# Altium schematic sheet 2_5Reg.SchDoc
size A4
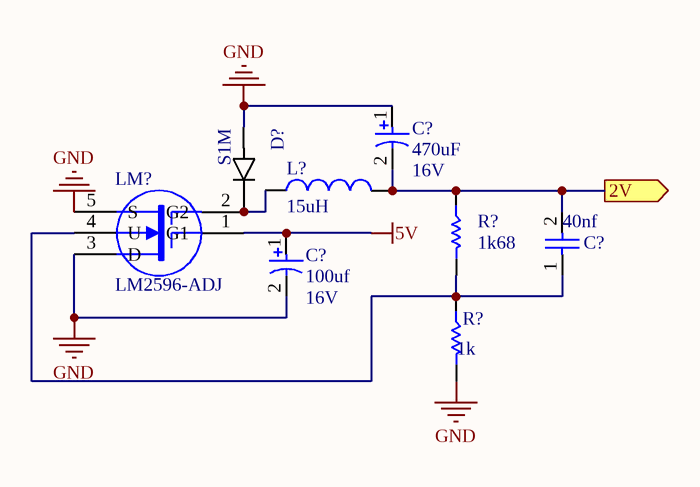
[diagram p0: 2_5Reg.SchDoc]

## Parts
(Parts that share a designator on the sheet are numbered #1, #2 ... from top to bottom, then left to right.)
C?#1  470uF  [RB5-10.5]
C?#2  40nf  [6-0805_L]
C?#3  100uf  [RB5-10.5]
D?  S1M  [*DIOM5227X270N_S1M(Primary)]
L?  15uH  [IND_SMD-13.0mm]
LM?  LM2596-ADJ  [T05A]
R?#1  1k68  [6-0805_L]
R?#2  1k  [6-0805_L]

## Ports
2V (out)

## Nets
5V: C?#3.1 LM?.1(G1)
GND: C?#1.1 C?#3.2 D?.A LM?.3(D) LM?.5(S) R?#2.2
2V: C?#1.2 C?#2.2 L?.2 R?#1.1 ; port 2V
NetC?#2_1: C?#2.1 LM?.4(U) R?#1.2 R?#2.1
NetD?_C: D?.C(K) L?.1 LM?.2(G2)

## Notes on the sheet
- Title
- Size:
- Date:
- A4
- Number:
- Time:
- Revision:
- Sheet
- of
- File:
- (in symbol CAP) 16V

## Library data of the parts
C?#1 C?#3 = CAP
C?#2 = CAP NON
D? = S1M: S1 Series 1000 V 1 A 1 uA Surface Mount General Purpose Rectifier - DO-214AC; MF: ON Semiconductor; Price: None; Availability: Unavailable; SnapEDA_Link: https://www.snapeda.com/parts/S1M/ON%20Semiconductor/view-part/?ref=snap; Package: DO-214AC-214 ON Semiconductor; MP: S1M; Value: *
L? = Inductor
LM? = MOSFET-N3: Two-Gate, N-Channel MOSFET, Externally Terminated Substrate; Published: 24-Mar-1999; LatestRevisionDate: 17-Jul-2002; LatestRevisionNote: Re-released for DXP Platform.; PackageReference: T05A; Publisher: Altium Limited; PackageDescription: TO-220, Molded, 5 Lead, Straight; Code_JEDEC: TS-001-AA
R?#1 R?#2 = RESISTOR